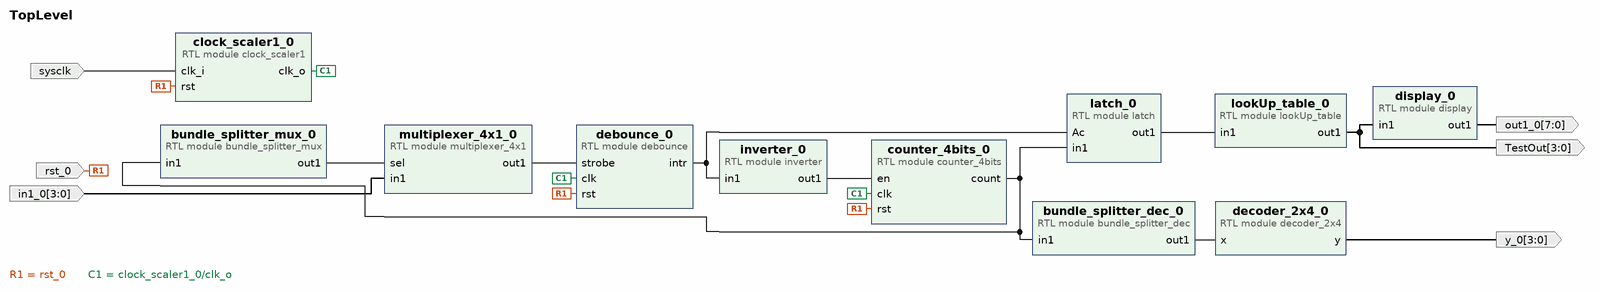
[diagram p0: block diagram of the top level]
# Vivado block design TopLevel, xc7z020clg400-1, Vivado 2018.3
create_bd_design TopLevel

create_bd_port -dir I -type rst rst_0
create_bd_port -dir I sysclk
create_bd_port -dir O -from 7 -to 0 out1_0
create_bd_port -dir O -from 3 -to 0 y_0
create_bd_port -dir I -from 3 -to 0 in1_0
create_bd_port -dir O -from 3 -to 0 TestOut

create_bd_cell -type module -reference counter_4bits counter_4bits_0
create_bd_cell -type module -reference decoder_2x4 decoder_2x4_0
create_bd_cell -type module -reference multiplexer_4x1 multiplexer_4x1_0
create_bd_cell -type module -reference bundle_splitter_mux bundle_splitter_mux_0
create_bd_cell -type module -reference bundle_splitter_dec bundle_splitter_dec_0
create_bd_cell -type module -reference inverter inverter_0
create_bd_cell -type module -reference lookUp_table lookUp_table_0
create_bd_cell -type module -reference latch latch_0
create_bd_cell -type module -reference debounce debounce_0
create_bd_cell -type module -reference display display_0
create_bd_cell -type module -reference clock_scaler1 clock_scaler1_0

# ---- connections ----

connect_bd_net -net rst_0_1 [get_bd_ports rst_0] [get_bd_pins counter_4bits_0/rst] [get_bd_pins debounce_0/rst] [get_bd_pins clock_scaler1_0/rst]
connect_bd_net -net bundle_splitter_dec_0_y [get_bd_pins bundle_splitter_dec_0/out1] [get_bd_pins decoder_2x4_0/x]
connect_bd_net -net bundle_splitter_mux_0_y [get_bd_pins bundle_splitter_mux_0/out1] [get_bd_pins multiplexer_4x1_0/sel]
connect_bd_net [get_bd_pins clock_scaler1_0/clk_o] [get_bd_pins counter_4bits_0/clk] [get_bd_pins debounce_0/clk]
connect_bd_net -net clk_i_0_1 [get_bd_ports sysclk] [get_bd_pins clock_scaler1_0/clk_i]
connect_bd_net [get_bd_pins inverter_0/out1] [get_bd_pins counter_4bits_0/en]
connect_bd_net [get_bd_pins latch_0/out1] [get_bd_pins lookUp_table_0/in1]
connect_bd_net [get_bd_pins counter_4bits_0/count] \
  [get_bd_pins latch_0/in1] [get_bd_pins bundle_splitter_dec_0/in1] [get_bd_pins bundle_splitter_mux_0/in1]
connect_bd_net [get_bd_pins multiplexer_4x1_0/out1] [get_bd_pins debounce_0/strobe]
connect_bd_net [get_bd_pins debounce_0/intr] [get_bd_pins inverter_0/in1] [get_bd_pins latch_0/Ac]
connect_bd_net [get_bd_pins lookUp_table_0/out1] [get_bd_pins display_0/in1] [get_bd_ports TestOut]
connect_bd_net [get_bd_pins display_0/out1] [get_bd_ports out1_0]
connect_bd_net [get_bd_pins decoder_2x4_0/y] [get_bd_ports y_0]
connect_bd_net -net in1_0_1 [get_bd_ports in1_0] [get_bd_pins multiplexer_4x1_0/in1]

validate_bd_design
save_bd_design
